# Altium schematic sheet keyboard_main.SchDoc
size A2
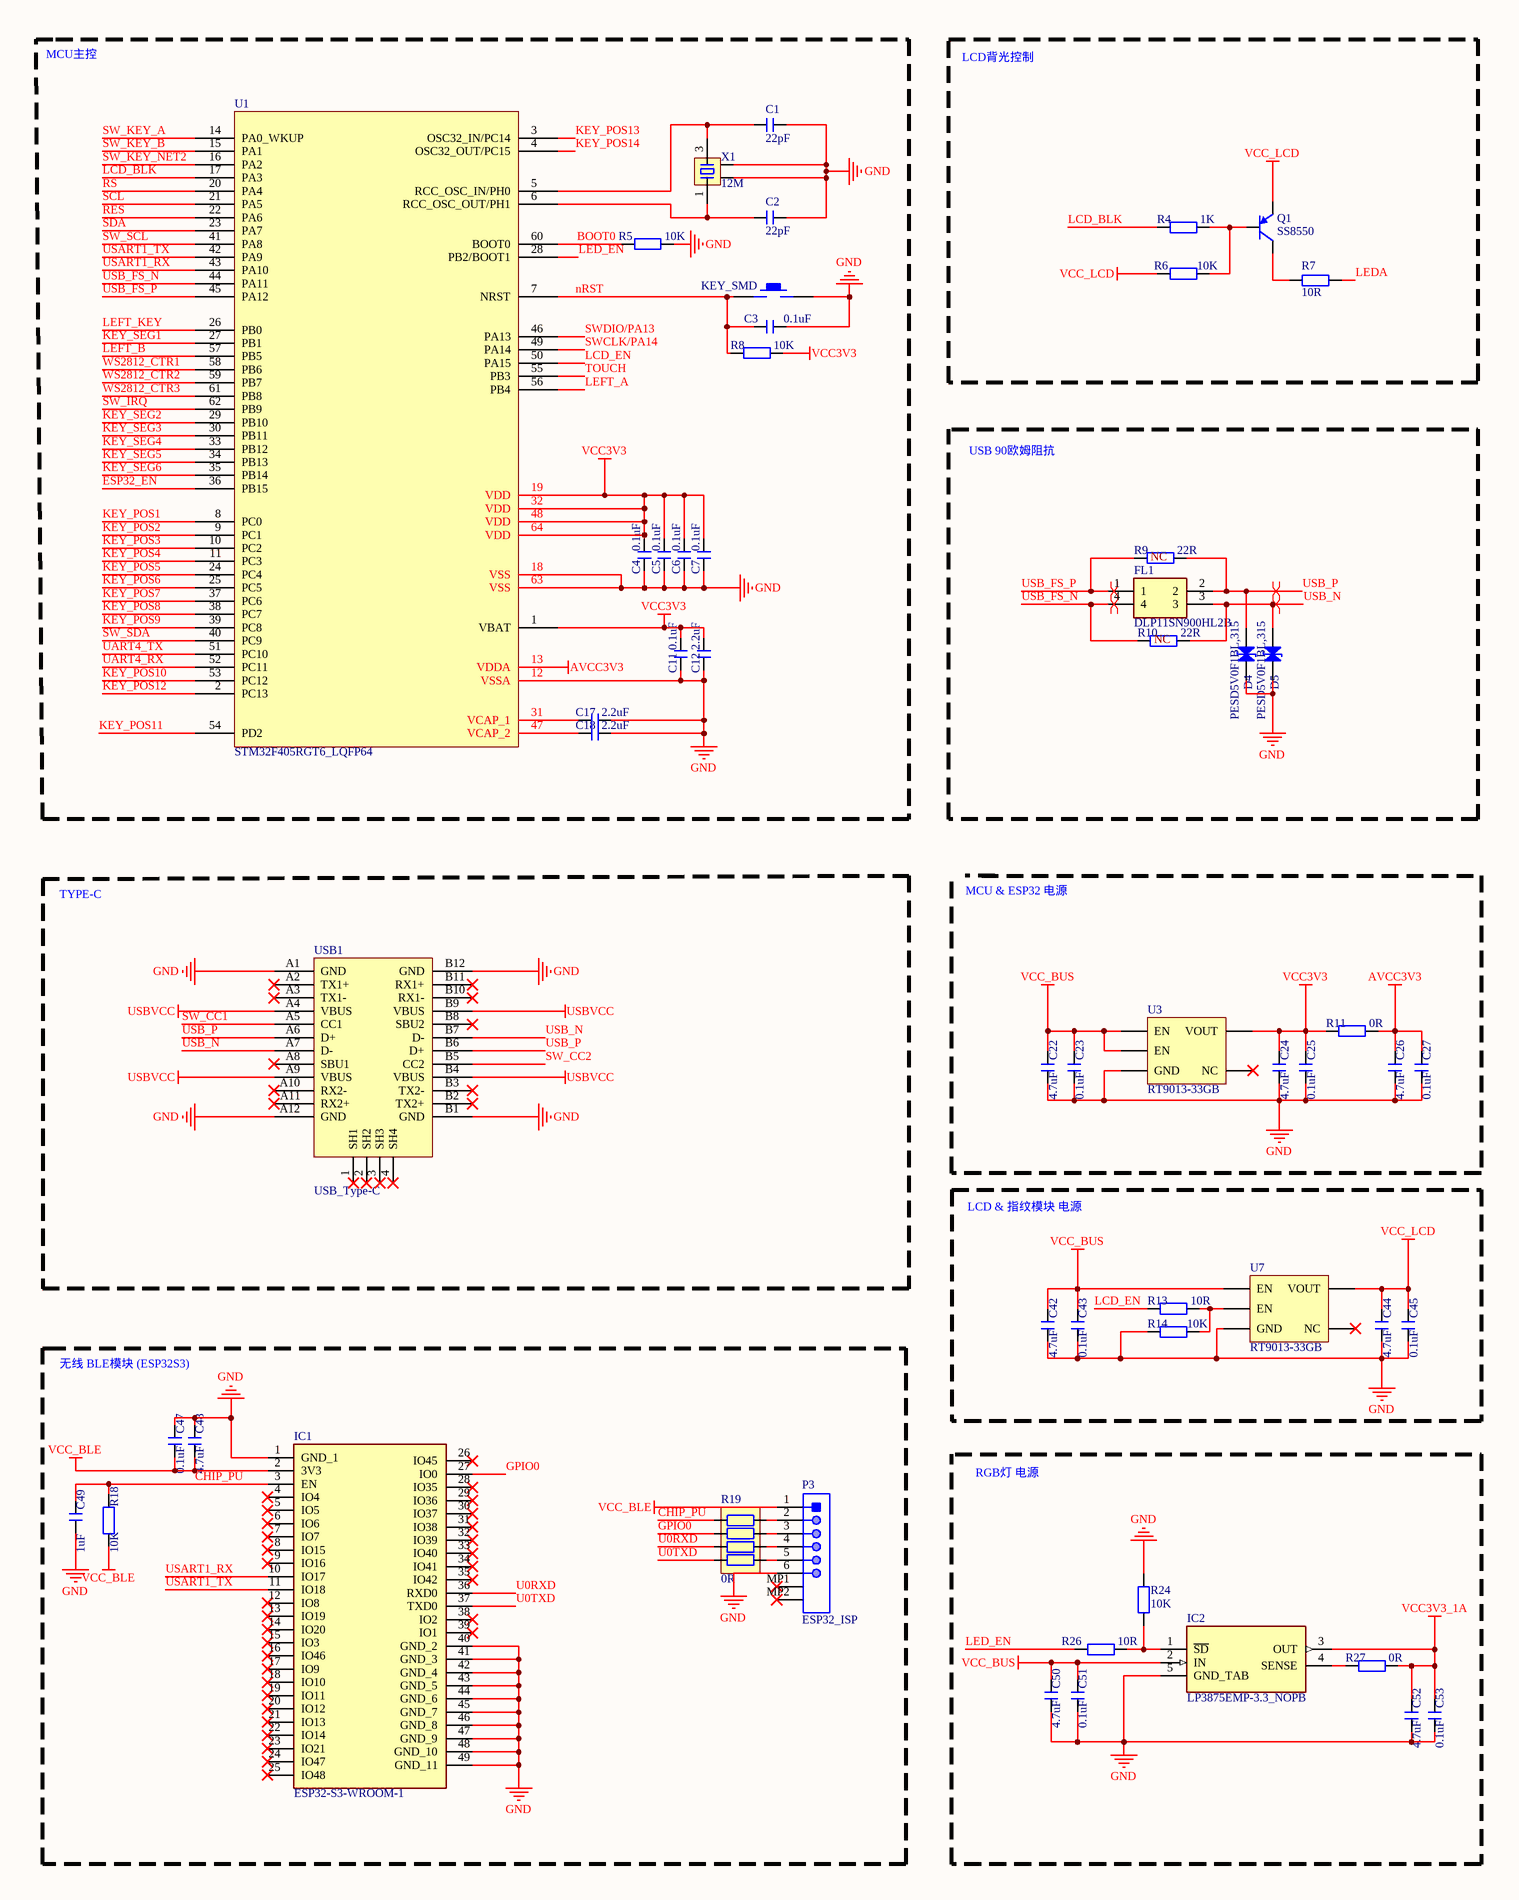
[diagram p0: keyboard_main.SchDoc, left]
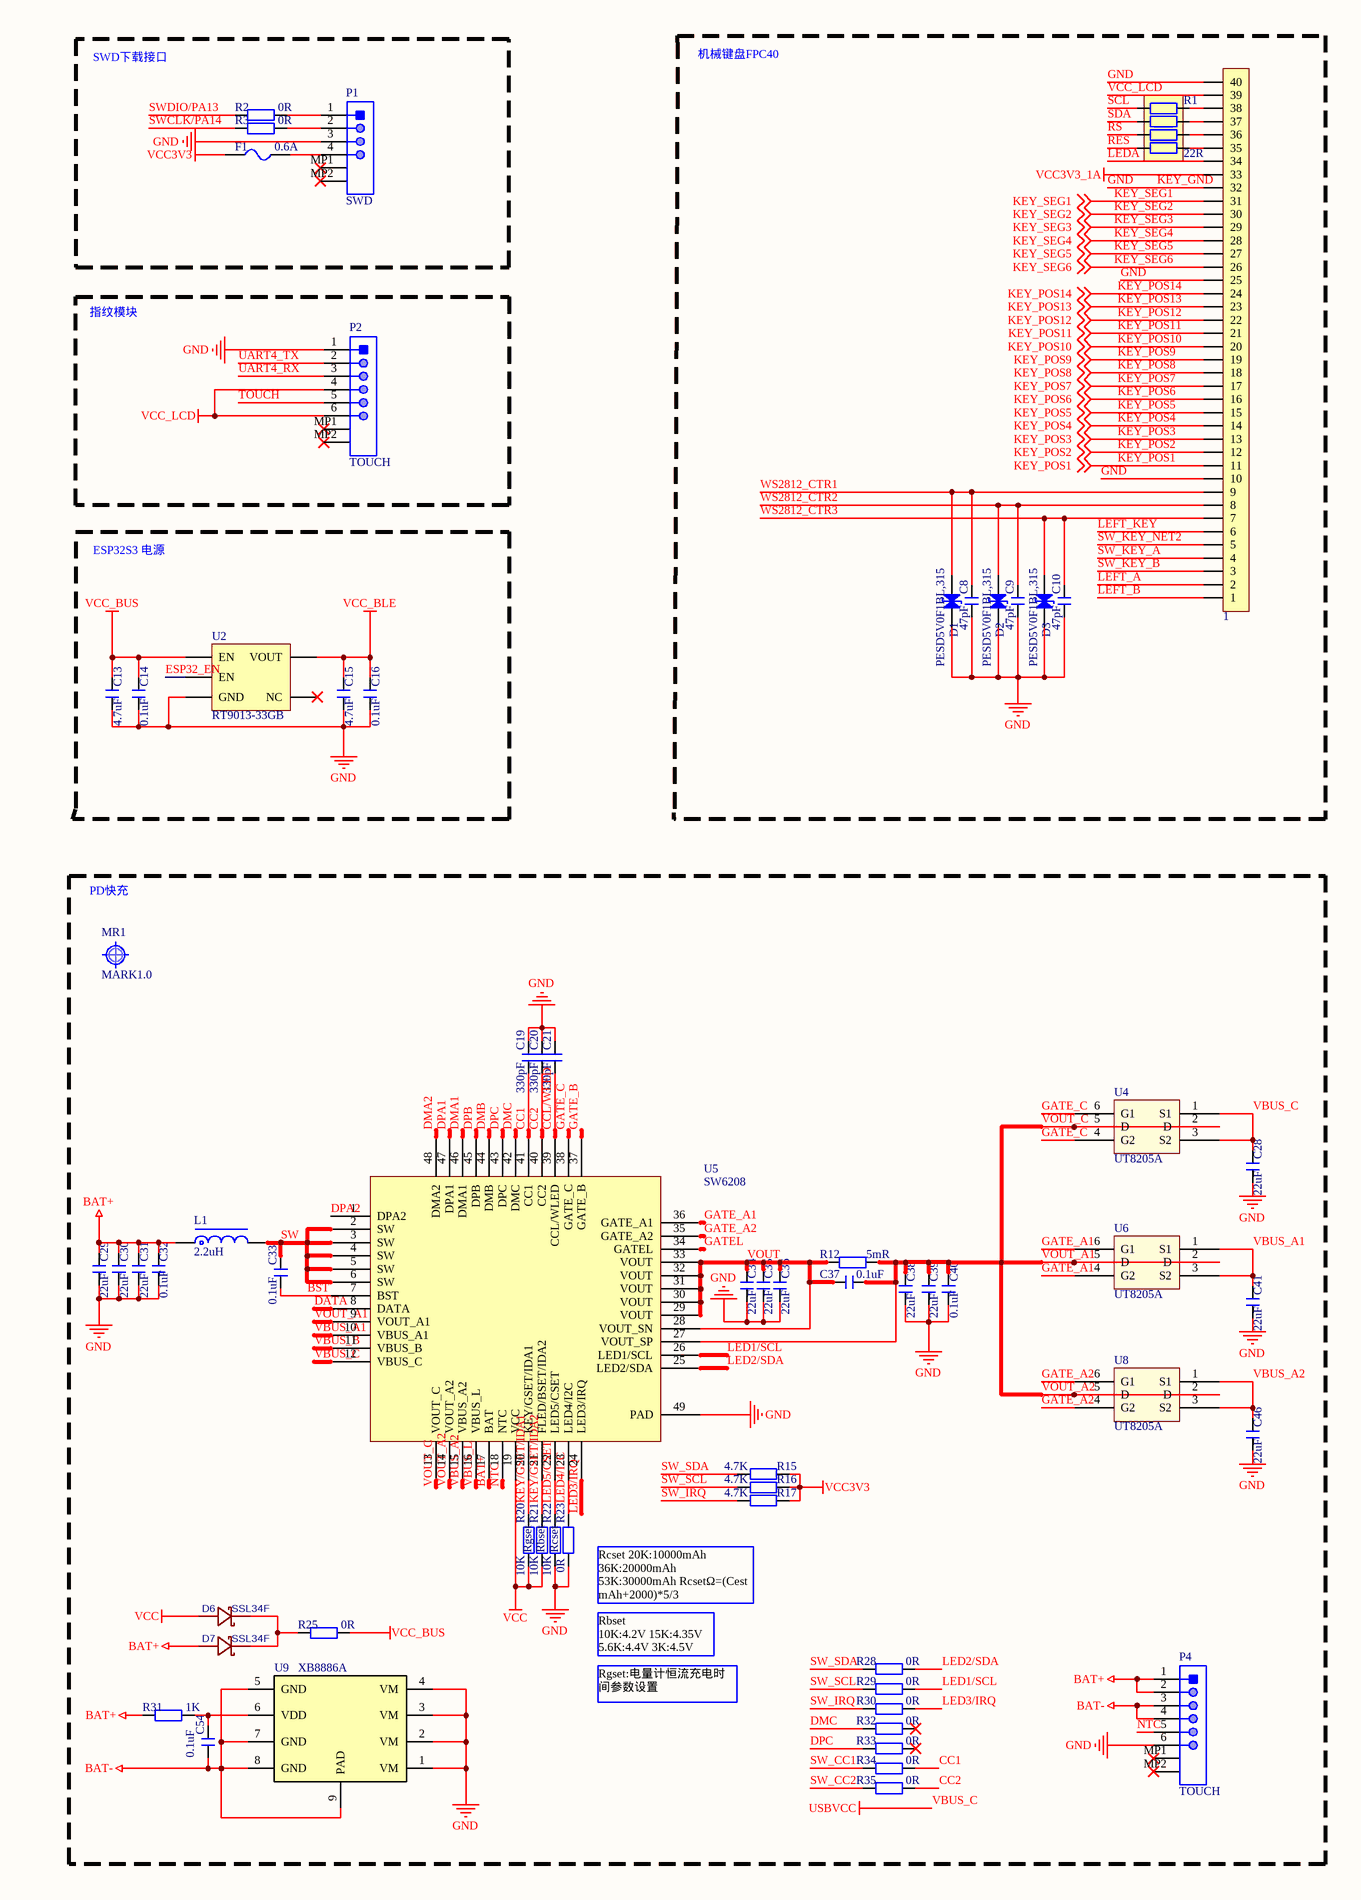
[diagram p1: keyboard_main.SchDoc, right]

## Parts
1  FPC1.0-40P  [FPC0.5 2H-WS-40P]  (value not drawn)
C1  22pF  [C 0402_L]
C2  22pF  [C 0402_L]
C3  0.1uF  [C 0402_L]
C4  0.1uF  [C 0402_L]
C5  0.1uF  [C 0402_L]
C6  0.1uF  [C 0402_L]
C7  0.1uF  [C 0402_L]
C8  47pF  [C 0402_L]
C9  47pF  [C 0402_L]
C10  47pF  [C 0402_L]
C11  0.1uF  [C 0402_L]
C12  2.2uF  [C 0402_L]
C13  4.7uF  [C 0402_L]
C14  0.1uF  [C 0402_L]
C15  4.7uF  [C 0402_L]
C16  0.1uF  [C 0402_L]
C17  2.2uF  [C 0402_L]
C18  2.2uF  [C 0402_L]
C19  330pF  [C 0402_L]
C20  330pF  [C 0402_L]
C21  330pF  [C 0402_L]
C22  4.7uF  [C 0402_L]
C23  0.1uF  [C 0402_L]
C24  4.7uF  [C 0402_L]
C25  0.1uF  [C 0402_L]
C26  4.7uF  [C 0402_L]
C27  0.1uF  [C 0402_L]
C28  22uF  [C 0805_L]
C29  22uF  [C 0805_L]
C30  22uF  [C 0805_L]
C31  22uF  [C 0805_L]
C32  0.1uF  [C 0805_L]
C33  0.1uF  [C 0603_L]
C34  22uF  [C 0805_L]
C35  22uF  [C 0805_L]
C36  22uF  [C 0805_L]
C37  0.1uF  [C 0805_L]
C38  22uF  [C 0805_L]
C39  22uF  [C 0805_L]
C40  0.1uF  [C 0805_L]
C41  22uF  [C 0805_L]
C42  4.7uF  [C 0402_L]
C43  0.1uF  [C 0402_L]
C44  4.7uF  [C 0402_L]
C45  0.1uF  [C 0402_L]
C46  22uF  [C 0805_L]
C47  0.1uF  [C 0402_L]
C48  4.7uF  [C 0402_L]
C49  1uF  [C 0402_L]
C50  4.7uF  [C 0402_L]
C51  0.1uF  [C 0402_L]
C52  4.7uF  [C 0402_L]
C53  0.1uF  [C 0402_L]
C54  0.1uF  [C 0805_L]
D1  PESD5V0F1BL,315  [SOD-882_L1.0-W0.6-BI]
D2  PESD5V0F1BL,315  [SOD-882_L1.0-W0.6-BI]
D3  PESD5V0F1BL,315  [SOD-882_L1.0-W0.6-BI]
D4  PESD5V0F1BL,315  [SOD-882_L1.0-W0.6-BI]
D5  PESD5V0F1BL,315  [SOD-882_L1.0-W0.6-BI]
D6  SSL34F  [SMAF_L3.5-W2.6-LS4.7-RD]
D7  SSL34F  [SMAF_L3.5-W2.6-LS4.7-RD]
F1  0.6A  [FU 0402]
FL1  DLP11SN900HL2B  [DLP11SA350HL2B]
IC1  ESP32-S3-WROOM-1  [ESP32S3WROOM1]
IC2  LP3875EMP-3.3_NOPB  [SOT150P700X180-5N]
KEY1  KEY_SMD  [SMD-3.2*4.2]
L1  2.2uH  [CD32]
MR1  MARK1.0  [Mark 1]
P1  SWD  [JST-SM04B-SRSS-TB_V]
P2  TOUCH  [JST-SM06B-SRSS-TB_V]
P3  ESP32_ISP  [JST-SM06B-SRSS-TB_V]
P4  TOUCH  [JST-SM06B-SRSS-TB_V]
Q1  SS8550  [SOT23-3N]
R1  22R  [RCA-8P4R-0402]
R2  0R  [R 0402_L]
R3  0R  [R 0402_L]
R4  1K  [R 0402_L]
R5  10K  [R 0402_L]
R6  10K  [R 0402_L]
R7  10R  [R 0402_L]
R8  10K  [R 0402_L]
R9  22R  [R 0402_L]
R10  22R  [R 0402_L]
R11  0R  [R 0402_L]
R12  5mR  [R 1206_L]
R13  10R  [R 0402_L]
R14  10K  [R 0402_L]
R15  4.7K  [R 0402_L]
R16  4.7K  [R 0402_L]
R17  4.7K  [R 0402_L]
R18  10K  [R 0402_L]
R19  0R  [RCA-8P4R-0402]
R20  10K  [R 0402_L]
R21  10K  [R 0402_L]
R22  10K  [R 0402_L]
R23  0R  [R 0402_L]
R24  10K  [R 0402_L]
R25  0R  [R 0402_L]
R26  10R  [R 0402_L]
R27  0R  [R 0402_L]
R28  0R  [R 0402_L]
R29  0R  [R 0402_L]
R30  0R  [R 0402_L]
R31  1K  [R 0402_L]
R32  0R  [R 0402_L]
R33  0R  [R 0402_L]
R34  0R  [R 0402_L]
R35  0R  [R 0402_L]
U1  STM32F405RGT6_LQFP64  [LQFP-64_10X10X05P]
U2  RT9013-33GB  [SOT23-5M]
U3  RT9013-33GB  [SOT23-5M]
U4  UT8205A  [SOT23-6]
U5  SW6208  [QFN-48_6x6]
U6  UT8205A  [SOT23-6]
U7  RT9013-33GB  [SOT23-5M]
U8  UT8205A  [SOT23-6]
U9  XB8886A  [SO-8-PAD]
USB1  USB_Type-C  [Type-C-TOP]
X1  12M  [OSC 3225-4P]

## Blocks framed on the sheet
MCU主控: C1-C7 C11 C12 C17 C18 KEY1 R5 R8 U1 X1
LCD背光控制: Q1 R4 R6 R7
SWD下载接口: F1 P1 R2 R3
指纹模块: P2
TYPE-C: USB1
LCD & 指纹模块 电源: C42-C45 R13 R14 U7
无线 BLE模块 (ESP32S3): C47-C49 IC1 P3 R18 R19
RGB灯 电源: C50-C53 IC2 R24 R26 R27

## Nets
AVCC3V3: C26.1 C27.1 R11.2 U1.13(VDDA)
BAT+: C29.2 C30.2 C31.2 C32.2 D7.2(A) L1.1 P4.1 P4.2 R31.1 U5.17(BAT)
BAT-: C54.1 P4.3 P4.4 U9.5(GND) U9.7(GND) U9.8(GND) U9.9(PAD)
GND: 1.10 1.25 1.32 1.40 C1.2 C2.2 C3.2 C4.1 C5.1 C6.1 C7.1 C8.1 C9.1 C10.1 C11.1 C12.1 C13.2 C14.2 C15.2 C16.2 C17.1 C18.1 C19.2 C20.2 C21.2 C22.2 C23.2 C24.2 C25.2 C26.2 C27.2 C28.1 C29.1 C30.1 C31.1 C32.1 C34.1 C35.1 C36.1 C38.1 C39.1 C40.1 C41.1 C42.2 C43.2 C44.2 C45.2 C46.1 C47.1 C48.1 C49.2 C50.2 C51.2 C52.2 C53.2 D1.2(K) D2.2(K) D3.2(K) D4.2(K) D5.2(K) IC1.1(GND_1) IC1.40(GND_2) IC1.41(GND_3) IC1.42(GND_4) IC1.43(GND_5) IC1.44(GND_6) IC1.45(GND_7) IC1.46(GND_8) IC1.47(GND_9) IC1.48(GND_10) IC1.49(GND_11) IC2.5(GND_TAB) KEY1.2 P1.3 P2.1 P3.6 P4.6 R5.2 R14.2 R22.2 R23.2 R24.1 U1.12(VSSA) U1.18(VSS) U1.63(VSS) U2.2(GND) U3.2(GND) U5.49(PAD) U7.2(GND) U9.1(VM) U9.2(VM) U9.3(VM) U9.4(VM) USB1.A1(GND) USB1.A12(GND) USB1.B1(GND) USB1.B12(GND) X1.2 X1.4  [also labelled KEY_GND]
VBUS_C: C28.2 U4.1(S1) U4.3(S2) U5.12(VBUS_C) USB1.A4(VBUS) USB1.A9(VBUS) USB1.B4(VBUS) USB1.B9(VBUS)  [also labelled USBVCC]
VCC: D6.2(A) R20.2 R21.2 U5.19(VCC)
VCC3V3: C4.2 C5.2 C6.2 C7.2 C11.2 C12.2 C24.1 C25.1 F1.1 R8.2 R11.1 R15.1 R16.1 R17.1 U1.1(VBAT) U1.19(VDD) U1.32(VDD) U1.48(VDD) U1.64(VDD) U3.5(VOUT)
VCC3V3_1A: 1.33 C52.1 C53.1 IC2.3(OUT) R27.2
VCC_BLE: C15.1 C16.1 C47.2 C48.2 IC1.2(3V3) P3.1 R18.2 U2.5(VOUT)
VCC_BUS: C13.1 C14.1 C22.1 C23.1 C42.1 C43.1 C50.1 C51.1 IC2.2(IN) R25.2 U2.1(EN) U3.1(EN) U3.3(EN) U7.1(EN)
VCC_LCD: 1.39 C44.1 C45.1 P2.4 P2.6 Q1.2(E) R6.2 U7.5(VOUT)
BOOT0: R5.1 U1.60(BOOT0)
BST: C33.1 U5.7(BST)
CC1: C19.1 R34.2 U5.41(CC1)
CC2: C20.1 R35.2 U5.40(CC2)
CCL/WLED: C21.1 U5.39(CCL/WLED)
CHIP_PU: C49.1 IC1.3(EN) R18.1 R19.8
DATA: U5.8(DATA)
DMA1: U5.46(DMA1)
DMA2: U5.48(DMA2)
DMB: U5.44(DMB)
DMC: R32.1 U5.42(DMC)
DPA1: U5.47(DPA1)
DPA2: U5.1(DPA2)
DPB: U5.45(DPB)
DPC: R33.1 U5.43(DPC)
ESP32_EN: U1.36(PB15) U2.3(EN)
GATE_A1: U5.36(GATE_A1) U6.4(G2) U6.6(G1)
GATE_A2: U5.35(GATE_A2) U8.4(G2) U8.6(G1)
GATE_B: U5.37(GATE_B)
GATE_C: U4.4(G2) U4.6(G1) U5.38(GATE_C)
GATEL: U5.34(GATEL)
GPIO0: IC1.27(IO0) R19.7
KEY/GSET/IDA1: R20.1 U5.20(KEY/GSET/IDA1)
KEY/GSET/IDA2: R21.1 U5.21(FLED/BSET/IDA2)
KEY_POS1: 1.11 U1.8(PC0) ; off-sheet KEY_POS1
KEY_POS2: 1.12 U1.9(PC1) ; off-sheet KEY_POS2
KEY_POS3: 1.13 U1.10(PC2) ; off-sheet KEY_POS3
KEY_POS4: 1.14 U1.11(PC3) ; off-sheet KEY_POS4
KEY_POS5: 1.15 U1.24(PC4) ; off-sheet KEY_POS5
KEY_POS6: 1.16 U1.25(PC5) ; off-sheet KEY_POS6
KEY_POS7: 1.17 U1.37(PC6) ; off-sheet KEY_POS7
KEY_POS8: 1.18 U1.38(PC7) ; off-sheet KEY_POS8
KEY_POS9: 1.19 U1.39(PC8) ; off-sheet KEY_POS9
KEY_POS10: 1.20 U1.53(PC12) ; off-sheet KEY_POS10
KEY_POS11: 1.21 U1.54(PD2) ; off-sheet KEY_POS11
KEY_POS12: 1.22 U1.2(PC13) ; off-sheet KEY_POS12
KEY_POS13: 1.23 U1.3(OSC32_IN/PC14) ; off-sheet KEY_POS13
KEY_POS14: 1.24 U1.4(OSC32_OUT/PC15) ; off-sheet KEY_POS14
KEY_SEG1: 1.31 U1.27(PB1) ; off-sheet KEY_SEG1
KEY_SEG2: 1.30 U1.29(PB10) ; off-sheet KEY_SEG2
KEY_SEG3: 1.29 U1.30(PB11) ; off-sheet KEY_SEG3
KEY_SEG4: 1.28 U1.33(PB12) ; off-sheet KEY_SEG4
KEY_SEG5: 1.27 U1.34(PB13) ; off-sheet KEY_SEG5
KEY_SEG6: 1.26 U1.35(PB14) ; off-sheet KEY_SEG6
LCD_BLK: R4.1 U1.17(PA3)
LCD_EN: R13.1 U1.50(PA15)
LED1/SCL: R29.2 U5.26(LED1/SCL)
LED2/SDA: R28.2 U5.25(LED2/SDA)
LED3/IRQ: R30.2 U5.24(LED3/IRQ)
LED4/I2C: R23.1 U5.23(LED4/I2C)
LED5/CSET: R22.1 U5.22(LED5/CSET)
LED_EN: R26.1 U1.28(PB2/BOOT1)
LEDA: 1.34 R7.1
LEFT_A: 1.2 U1.56(PB4)
LEFT_B: 1.1 U1.57(PB5)
LEFT_KEY: 1.6 U1.26(PB0)
nRST: C3.1 KEY1.1 R8.1 U1.7(NRST)
NTC: P4.5 U5.18(NTC)
RES: R1.4 U1.22(PA6)
RS: R1.3 U1.20(PA4)
SCL: R1.1 U1.21(PA5)
SDA: R1.2 U1.23(PA7)
SW: C33.2 L1.2 U5.2(SW) U5.3(SW) U5.4(SW) U5.5(SW) U5.6(SW)
SW_CC1: R34.1 USB1.A5(CC1)
SW_CC2: R35.1 USB1.B5(CC2)
SW_IRQ: R17.2 R30.1 U1.62(PB9)
SW_KEY_A: 1.4 U1.14(PA0_WKUP)
SW_KEY_B: 1.3 U1.15(PA1)
SW_KEY_NET2: 1.5 U1.16(PA2)
SW_SCL: R16.2 R29.1 U1.41(PA8)
SW_SDA: R15.2 R28.1 U1.40(PC9)
SWCLK/PA14: R3.1 U1.49(PA14)
SWDIO/PA13: R2.1 U1.46(PA13)
TOUCH: P2.5 U1.55(PB3)
U0RXD: IC1.36(RXD0) R19.6
U0TXD: IC1.37(TXD0) R19.5
UART4_RX: P2.3 U1.52(PC11)
UART4_TX: P2.2 U1.51(PC10)
USART1_RX: IC1.10(IO17) U1.43(PA10)
USART1_TX: IC1.11(IO18) U1.42(PA9)
USB_FS_N: FL1.4 R10.1 U1.44(PA11)
USB_FS_P: FL1.1 R9.1 U1.45(PA12)
USB_N: D5.1(A) FL1.3 R10.2 USB1.A7(D-) USB1.B7(D-)
USB_P: D4.1(A) FL1.2 R9.2 USB1.A6(D+) USB1.B6(D+)
VBUS_A1: C41.2 U5.10(VBUS_A1) U6.1(S1) U6.3(S2)
VBUS_A2: C46.2 U5.15(VBUS_A2) U8.1(S1) U8.3(S2)
VBUS_B: U5.11(VBUS_B)
VBUS_L: U5.16(VBUS_L)
VOUT: C34.2 C35.2 C36.2 C37.1 R12.1 U5.28(VOUT_SN) U5.29(VOUT) U5.30(VOUT) U5.31(VOUT) U5.32(VOUT) U5.33(VOUT)
VOUT_A1: C37.2 C38.2 C39.2 C40.2 R12.2 U4.2(D) U4.5(D) U5.9(VOUT_A1) U5.13(VOUT_C) U5.14(VOUT_A2) U5.27(VOUT_SP) U6.2(D) U6.5(D) U8.2(D) U8.5(D)  [also labelled VOUT_A2, VOUT_C]
WS2812_CTR1: 1.9 C8.2 D1.1(A) U1.58(PB6)
WS2812_CTR2: 1.8 C9.2 D2.1(A) U1.59(PB7)
WS2812_CTR3: 1.7 C10.2 D3.1(A) U1.61(PB8)
Net1_35: 1.35 R1.5
Net1_36: 1.36 R1.6
Net1_37: 1.37 R1.7
Net1_38: 1.38 R1.8
NetC1_1: C1.1 U1.5(RCC_OSC_IN/PH0) X1.3
NetC2_1: C2.1 U1.6(RCC_OSC_OUT/PH1) X1.1
NetC17_2: C17.2 U1.31(VCAP_1)
NetC18_2: C18.2 U1.47(VCAP_2)
NetC54_2: C54.2 R31.2 U9.6(VDD)
NetD6_1: D6.1(K) D7.1(K) R25.1
NetF1_2: F1.2 P1.4
NetIC2_1: IC2.1(~{SD}) R24.2 R26.2
NetIC2_4: IC2.4(SENSE) R27.1
NetP1_1: P1.1 R2.2
NetP1_2: P1.2 R3.2
NetP3_2: P3.2 R19.1
NetP3_3: P3.3 R19.2
NetP3_4: P3.4 R19.3
NetP3_5: P3.5 R19.4
NetQ1_1: Q1.1(B) R4.2 R6.1
NetQ1_3: Q1.3(C) R7.2
NetR13_2: R13.2 R14.1 U7.3(EN)

Not connected (* = marked no-connect by the designer): IC1 4(IO4)* 5(IO5)* 6(IO6)* 7(IO7)* 8(IO15)* 9(IO16)* 12(IO8)* 13(IO19)* 14(IO20)* 15(IO3)* 16(IO46)* 17(IO9)* 18(IO10)* 19(IO11)* 20(IO12)* 21(IO13)* 22(IO14)* 23(IO21)* 24(IO47)* 25(IO48)* 26(IO45)* 28(IO35)* 29(IO36)* 30(IO37)* 31(IO38)* 32(IO39)* 33(IO40)* 34(IO41)* 35(IO42)* 38(IO2)* 39(IO1)*; P1 MP1* MP2*; P2 MP1* MP2*; P3 MP1* MP2*; P4 MP1* MP2*; R32 2*; R33 2*; U2 4(NC)*; U3 4(NC)*; U7 4(NC)*; USB1 1(SH1)* 2(SH2)* 3(SH3)* 4(SH4)* A2(TX1+)* A3(TX1-)* A8(SBU1)* A10(RX2-)* A11(RX2+)* B2(TX2+)* B3(TX2-)* B8(SBU2)* B10(RX1-)* B11(RX1+)*

## Layout directives
differential pair: USB_FS_N, USB_FS_P, USB_N, USB_P

## Notes on the sheet
- 机械键盘FPC40
- USB 90欧姆阻抗
- (near R9) NC
- ESP32S3 电源
- (near R10) NC
- MCU & ESP32 电源
- PD快充
- (near R20) Rgset
- (near R21) Rbset
- (near R22) Rcset
- Rcset 20K:10000mAh 36K:20000mAh 53K:30000mAh RcsetΩ=(Cest mAh+2000)*5/3
- Rbset
  10K:4.2V 15K:4.35V 5.6K:4.4V 3K:4.5V
- Rgset:电量计恒流充电时间参数设置
- Title
- Size:
- Date:
- File:
- A2
- Number:
- Time:
- Revision:
- Sheet
- of

## Library data of the parts
1 = FPC-40P: FPC连接器; 版权归属: 黎明电子style; BOM名称: FPC连接器; 学习资源: https://lmdzstyle.taobao.com/
C1-C54 = C: 贴片电容
D1-D5 = PESD5V0F1BL,315: PESD5V0F1BL,315、ESD二极管、5.5V
D6 D7 = SSL34F_C1884559: BOM_Manufacturer: YFW佑风微; Contributor: LCSC; BOM_Supplier: LCSC; BOM_Supplier Part: C1884559; BOM_Manufacturer Part: SSL34F; BOM_JLCPCB Part Class: Extended Part; spicePre: D; spiceSymbolName: SSL34F_C1884559
F1 = FU: 贴片保险丝
FL1 = DLP11SN900HL2B: Filter; Manufacturer_Name: Murata Electronics; Datasheet Link: https://www.murata.com/en-us/products/productdetail?partno=DLP11SN900HL2%23; Height: 0.92mm; Manufacturer_Part_Number: DLP11SN900HL2B; Mouser Part Number: 81-DLP11SN900HL2B; Mouser Price/Stock: https://www.mouser.co.uk/ProductDetail/Murata-Electronics/DLP11SN900HL2B?qs=%2F%252BYoplLUB5ikZtvOhZcMEg%3D%3D
IC1 = ESP32-S3-WROOM-1: Integrated Circuit; Manufacturer_Name: Espressif Systems; Datasheet Link: https://www.mouser.com/catalog/specsheets/Espressif_ESP32_S3_WROOM_1_1U_Preliminary.pdf; Height: 3.25mm; Manufacturer_Part_Number: ESP32-S3-WROOM-1
IC2 = LP3875EMP-3.3_NOPB: Integrated Circuit; Manufacturer_Name: Texas Instruments; Manufacturer_Part_Number: LP3875EMP-3.3/NOPB; Datasheet Link: http://www.ti.com/lit/ds/symlink/lp3875.pdf; Height: 1.8mm; Mouser Part Number: 926-LP3875EMP33NOPB; Mouser Price/Stock: https://www.mouser.co.uk/ProductDetail/Texas-Instruments/LP3875EMP-33-NOPB/?qs=1FNqv8aZn1T8BQ9vh08sWQ%3D%3D; Arrow Part Number: LP3875EMP-3.3/NOPB; Arrow Price/Stock: https://www.arrow.com/en/products/lp3875emp-3.3nopb/texas-instruments
L1 = L-SMD: CD系列贴片线绕功率电感
MR1 = MARK: 光学定位点
P1 = SM04B-SRSS-TB(LF)(SN): Male Header, Pitch 1 mm, 1 x 4 Position, Height 2.9 mm, -25 to 85 degC, RoHS, Tape and Reel; Manufacturer: JST; Pitch: 1mm; Style/Orientation: RightAngleHeader/Plug; No of Positions: 4; Package Description: Male Header, Pitch 1 mm, 1 x 4 Position, Height 2.9 mm; Manufacturer URL: http://www.jst.com/home2.html; Package Reference: SM04B-SRSS-TB(LF)(SN); Type: ShroudedHeader; Termination: Crimp; Mounting Technology: SurfaceMount; Datasheet Version: 05/2016; Datasheet URL: http://www.jst-mfg.com/product/pdf/eng/eSR.pdf
P2-P4 = SM06B-SRSS-TB(LF)(SN): Male Header, Pitch 1 mm, 1 x 6 Position, Height 2.9 mm, -25 to 85 degC, RoHS, Tape and Reel; Manufacturer: JST; No of Positions: 6; Pitch: 1mm; Style/Orientation: RightAngleHeader/Plug; Datasheet URL: http://www.jst-mfg.com/product/pdf/eng/eSR.pdf; Package Description: Male Header, Pitch 1 mm, 1 X 6 Position, Height 2.9 mm; Termination: Solder; Manufacturer URL: http://www.jst.com/home2.html; Type: ShroudedHeader; Package Reference: SM06B-SRSS-TB(LF)(SN); Datasheet Version: 05/2016; Mounting Technology: SurfaceMount
Q1 = 8550-SMD: 高频放大-PNP型
R1 R19 = R-8P4R: 贴片排阻
R2-R18 R20-R35 = R: 贴片电阻
U5 = SW6208: 充电宝芯片
U9 = XB8886A: MF: Texas Instruments; MP: NE5532D; Value: *; Package: SOIC-8 Texas Instruments; Price: None; Availability: Unavailable; SnapEDA_Link: https://www.snapeda.com/parts/NE5532D/Texas%20Instruments/view-part/4299479/?ref=snap
X1 = XTAL-4P: 4脚无源晶振